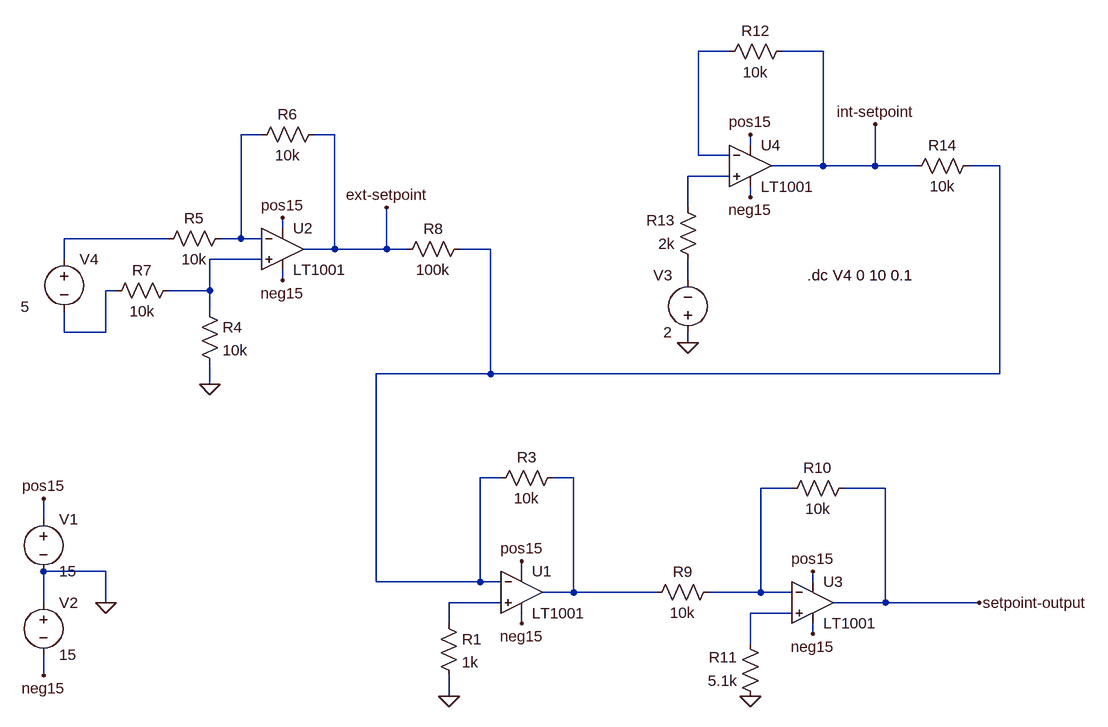
[diagram p0: schematic ext-setpoint.asc]
ext-setpoint.asc, the LTspice schematic file:
Version 4
SHEET 1 1172 680
WIRE 48 -656 0 -656
WIRE 192 -656 128 -656
WIRE -672 -528 -704 -528
WIRE -560 -528 -592 -528
WIRE 80 -512 80 -528
WIRE 0 -496 0 -656
WIRE 48 -496 0 -496
WIRE 192 -480 192 -656
WIRE 192 -480 112 -480
WIRE 272 -480 272 -544
WIRE 272 -480 192 -480
WIRE 336 -480 272 -480
WIRE 464 -480 416 -480
WIRE 48 -464 -16 -464
WIRE 80 -432 80 -448
WIRE -16 -416 -16 -464
WIRE -640 -384 -640 -400
WIRE -816 -368 -976 -368
WIRE -704 -368 -704 -528
WIRE -704 -368 -736 -368
WIRE -672 -368 -704 -368
WIRE -560 -352 -560 -528
WIRE -560 -352 -608 -352
WIRE -480 -352 -480 -416
WIRE -480 -352 -560 -352
WIRE -448 -352 -480 -352
WIRE -320 -352 -368 -352
WIRE -976 -336 -976 -368
WIRE -672 -336 -752 -336
WIRE -640 -304 -640 -320
WIRE -16 -304 -16 -336
WIRE -896 -288 -912 -288
WIRE -752 -288 -752 -336
WIRE -752 -288 -816 -288
WIRE -752 -256 -752 -288
WIRE -976 -224 -976 -256
WIRE -912 -224 -912 -288
WIRE -912 -224 -976 -224
WIRE -16 -208 -16 -224
WIRE -320 -160 -320 -352
WIRE -320 -160 -496 -160
WIRE 464 -160 464 -480
WIRE 464 -160 -320 -160
WIRE -752 -144 -752 -176
WIRE -304 0 -336 0
WIRE -192 0 -224 0
WIRE 144 16 96 16
WIRE 288 16 224 16
WIRE -1008 64 -1008 32
WIRE -912 144 -1008 144
WIRE -272 144 -272 128
WIRE -496 160 -496 -160
WIRE -336 160 -336 0
WIRE -336 160 -496 160
WIRE -304 160 -336 160
WIRE 176 160 176 144
WIRE -192 176 -192 0
WIRE -192 176 -240 176
WIRE -64 176 -192 176
WIRE 96 176 96 16
WIRE 96 176 16 176
WIRE 144 176 96 176
WIRE -1008 192 -1008 144
WIRE -912 192 -912 144
WIRE -304 192 -384 192
WIRE 288 192 288 16
WIRE 288 192 208 192
WIRE 432 192 288 192
WIRE 144 208 80 208
WIRE -384 224 -384 192
WIRE -272 224 -272 208
WIRE 176 240 176 224
WIRE 80 256 80 208
WIRE -1008 304 -1008 272
WIRE -384 336 -384 304
FLAG -384 336 0
FLAG -912 192 0
FLAG -1008 32 pos15
FLAG -1008 304 neg15
FLAG -272 128 pos15
FLAG -272 224 neg15
FLAG -752 -144 0
FLAG -640 -400 pos15
FLAG -640 -304 neg15
FLAG 176 144 pos15
FLAG 176 240 neg15
FLAG 80 336 0
FLAG 80 -528 pos15
FLAG 80 -432 neg15
FLAG -16 -208 0
FLAG -480 -416 ext-setpoint
FLAG 272 -544 int-setpoint
FLAG 432 192 setpoint-output
SYMBOL Opamps\\LT1001 -272 112 R0
SYMATTR InstName U1
SYMBOL res -400 208 R0
SYMATTR InstName R1
SYMATTR Value 1k
SYMBOL res -208 -16 R90
WINDOW 0 0 56 VBottom 0
WINDOW 3 32 56 VTop 0
SYMATTR InstName R3
SYMATTR Value 10k
SYMBOL voltage -1008 48 R0
WINDOW 123 0 0 Left 0
WINDOW 39 0 0 Left 0
SYMATTR InstName V1
SYMATTR Value 15
SYMBOL voltage -1008 176 R0
WINDOW 123 0 0 Left 0
WINDOW 39 0 0 Left 0
SYMATTR InstName V2
SYMATTR Value 15
SYMBOL Opamps\\LT1001 -640 -416 R0
SYMATTR InstName U2
SYMBOL res -768 -272 R0
SYMATTR InstName R4
SYMATTR Value 10k
SYMBOL res -720 -384 R90
WINDOW 0 0 56 VBottom 0
WINDOW 3 32 56 VTop 0
SYMATTR InstName R5
SYMATTR Value 10k
SYMBOL res -576 -544 R90
WINDOW 0 0 56 VBottom 0
WINDOW 3 32 56 VTop 0
SYMATTR InstName R6
SYMATTR Value 10k
SYMBOL voltage -976 -352 R0
WINDOW 3 -67 89 Left 0
WINDOW 123 0 0 Left 0
WINDOW 39 0 0 Left 0
SYMATTR Value 5
SYMATTR InstName V4
SYMBOL res -800 -304 R90
WINDOW 0 0 56 VBottom 0
WINDOW 3 32 56 VTop 0
SYMATTR InstName R7
SYMATTR Value 10k
SYMBOL res -352 -368 R90
WINDOW 0 0 56 VBottom 0
WINDOW 3 32 56 VTop 0
SYMATTR InstName R8
SYMATTR Value 100k
SYMBOL res 32 160 R90
WINDOW 0 0 56 VBottom 0
WINDOW 3 32 56 VTop 0
SYMATTR InstName R9
SYMATTR Value 10k
SYMBOL res 240 0 R90
WINDOW 0 0 56 VBottom 0
WINDOW 3 32 56 VTop 0
SYMATTR InstName R10
SYMATTR Value 10k
SYMBOL res 96 352 R180
WINDOW 0 36 76 Left 0
WINDOW 3 36 40 Left 0
SYMATTR InstName R11
SYMATTR Value 5.1k
SYMBOL Opamps\\LT1001 176 128 R0
SYMATTR InstName U3
SYMBOL res 144 -672 R90
WINDOW 0 0 56 VBottom 0
WINDOW 3 32 56 VTop 0
SYMATTR InstName R12
SYMATTR Value 10k
SYMBOL res 0 -320 R180
WINDOW 0 36 76 Left 0
WINDOW 3 36 40 Left 0
SYMATTR InstName R13
SYMATTR Value 2k
SYMBOL Opamps\\LT1001 80 -544 R0
SYMATTR InstName U4
SYMBOL res 432 -496 R90
WINDOW 0 0 56 VBottom 0
WINDOW 3 32 56 VTop 0
SYMATTR InstName R14
SYMATTR Value 10k
SYMBOL voltage -16 -208 R180
WINDOW 0 24 104 Left 0
WINDOW 3 24 16 Left 0
WINDOW 123 0 0 Left 0
WINDOW 39 0 0 Left 0
SYMATTR InstName V3
SYMATTR Value 2
TEXT 168 -312 Left 0 !.dc V4 0 10 0.1

The netlist it stands for:
* ext-setpoint.asc
XU1 N011 N003 pos15 neg15 N009 LT1001  ; pins In+ In- V+ V- OUT
R1 N011 0 1k
R3 N009 N003 10k
V1 pos15 0 15
V2 0 neg15 15
XU2 N006 N002 pos15 neg15 ext-setpoint LT1001  ; pins In+ In- V+ V- OUT
R4 N006 0 10k
R5 N002 N005 10k
R6 ext-setpoint N002 10k
V4 N005 N008 5
R7 N006 N008 10k
R8 N003 ext-setpoint 100k
R9 N010 N009 10k
R10 setpoint-output N010 10k
R11 0 N012 5.1k
XU3 N012 N010 pos15 neg15 setpoint-output LT1001  ; pins In+ In- V+ V- OUT
R12 int-setpoint N001 10k
R13 N007 N004 2k
XU4 N004 N001 pos15 neg15 int-setpoint LT1001  ; pins In+ In- V+ V- OUT
R14 N003 int-setpoint 10k
V3 0 N007 2
.dc V4 0 10 0.1
.lib LTC.lib
.backanno
.end

* Results of the author's LTspice run, read from the files saved beside the schematic
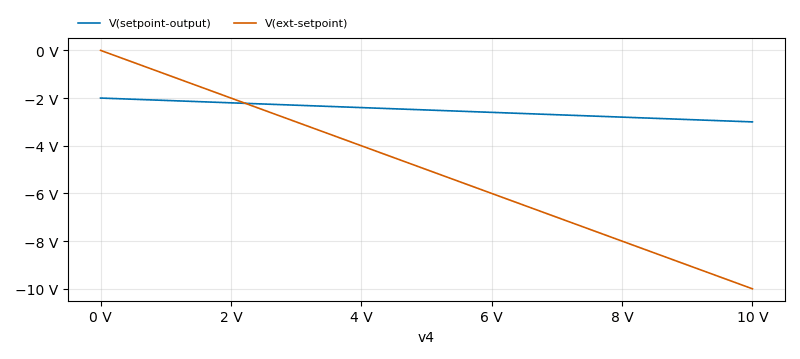
[diagram p1: DC transfer characteristic of ext-setpoint.asc, plotted from the saved traces]
* DC transfer characteristic, 1 run:
*   V(setpoint-output): -2 V at v4=0 V, -3 V at v4=10 V, min -3 V, max -2 V
*   V(ext-setpoint): 44.89 µV at v4=0 V, -10 V at v4=10 V, min -10 V, max 44.89 µV